# EAGLE schematic MVP (EAGLE 7.5.0)
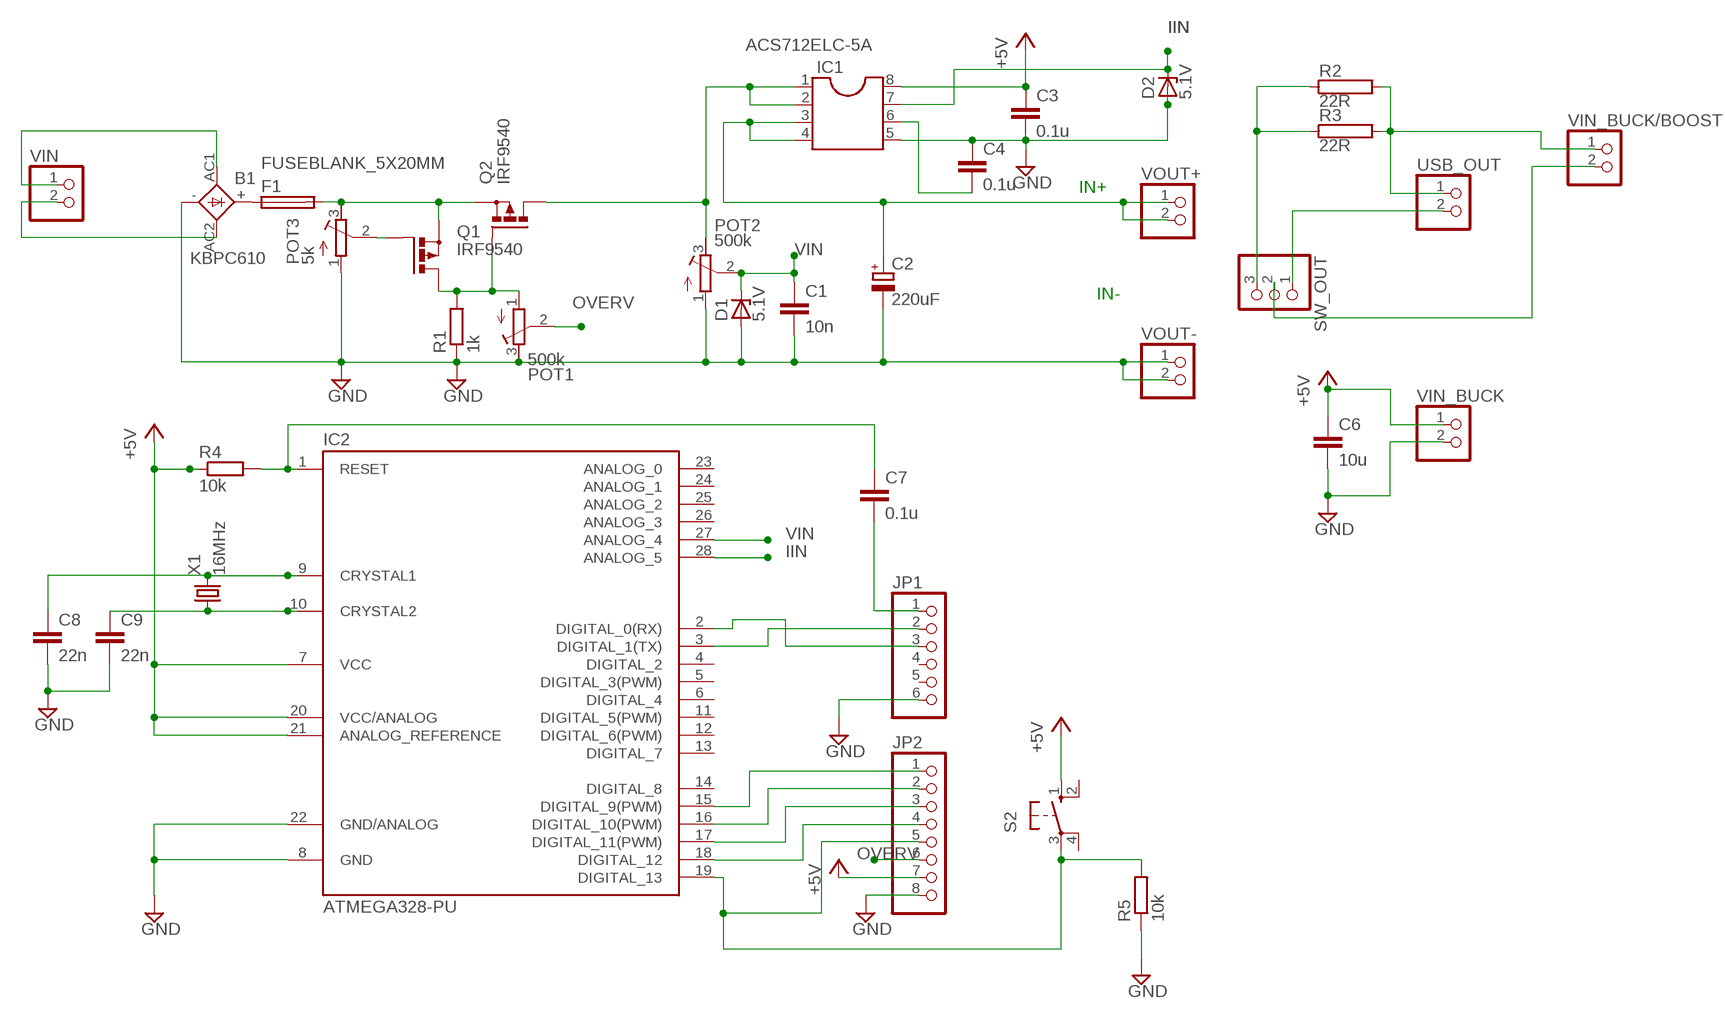
[diagram p0: schematic, sheet 1]

## Parts
B1  KBPC610  GBPC6  [GBPC6]
C1  10n  C-EUC1206K  [C1206K]
C2  220uF  CPOL-EUE3.5-10  [E3,5-10]
C3  0.1u  C-EUC1206K  [C1206K]
C4  0.1u  C-EUC1206K  [C1206K]
C6  10u  C-EUC1206K  [C1206K]
C7  0.1u  C-EUC1206K  [C1206K]
C8  22n  C-EUC0805K  [C0805K]
C9  22n  C-EUC0805K  [C0805K]
D1  5.1V  ZPD  [DO35Z10]
D2  5.1V  ZPD  [DO35Z10]
F1  FUSEBLANK_5X20MM  [FUSE_HOLDER_5X20MM]
IC1  ACS712ELC-5A  SOIC8  [SOIC8]
IC2  ATMEGA328-PU  ATMEGA168-PU  [DIL28-3]
JP1  PINHD-1X6  [1X06]
JP2  PINHD-1X8  [1X08]
POT1  500k  R-TRIMM3296W  [RTRIM3296W]
POT2  500k  R-TRIMM3296W  [RTRIM3296W]
POT3  5k  R-TRIMM3296W  [RTRIM3296W]
Q1  IRF9540  PMOSFET_PTO220BV  [TO220BV]
Q2  IRF9540  PMOSFET_PTO220BV  [TO220BV]
R1  1k  R-EU_VTA52  [VTA52]
R2  22R  RRWM8X45  [RWM8X45]
R3  22R  RRWM8X45  [RWM8X45]
R4  10k  R-EU_R1206  [R1206]
R5  10k  R-EU_R1206  [R1206]
S2  10-XX  [B3F-10XX]
SW_OUT  PINHD-1X3  [1X03]
USB_OUT  PINHD-1X2  [1X02]
VIN  PINHD-1X2  [1X02]
VIN_BUCK  PINHD-1X2  [1X02]
VIN_BUCK/BOOST  PINHD-1X2  [1X02]
VOUT+  PINHD-1X2  [1X02]
VOUT-  PINHD-1X2  [1X02]
X1  16MHz  CRYSTALHC49S  [HC49/S]

## Nets
+5V: C3.1 C6.1 IC1.8 IC2.7(VCC) IC2.20(VCC/ANALOG) IC2.21(ANALOG_REFERENCE) JP2.7 R4.1 S2.1(S) VIN_BUCK.1
GND: B1.- C1.2 C2.- C3.2 C4.1 C6.2 C8.2 C9.2 D1.A D2.A IC1.5 IC2.8(GND) IC2.22(GND/ANALOG) JP1.6 JP2.8 POT1.3(E) POT2.1(A) POT3.1(A) R1.1 R5.1 VIN_BUCK.2 VOUT-.1 VOUT-.2
IIN: D2.C IC1.7 IC2.28(ANALOG_5)
M1S: C2.+ IC1.3 IC1.4 VOUT+.1 VOUT+.2
N$1: B1.+ F1.1
N$2: C4.2 IC1.6
N$3: IC1.1 IC1.2 POT2.3(E) Q2.D
N$4: IC2.3(DIGITAL_1(TX)) JP1.2
N$5: IC2.2(DIGITAL_0(RX)) JP1.3
N$6: IC2.15(DIGITAL_9(PWM)) JP2.1
N$7: POT3.2(S) Q1.G
N$8: IC2.19(DIGITAL_13) JP2.5 R5.2 S2.3(P)
N$9: IC2.16(DIGITAL_10(PWM)) JP2.2
N$10: F1.2 POT3.3(E) Q1.S Q2.S
N$11: IC2.17(DIGITAL_11(PWM)) JP2.3
N$12: IC2.18(DIGITAL_12) JP2.4
N$14: C7.2 JP1.1
N$15: C9.1 IC2.10(CRYSTAL2) X1.1
N$16: C8.1 IC2.9(CRYSTAL1) X1.2
N$17: C7.1 IC2.1(RESET) R4.2
N$19: B1.AC2 VIN.2
N$20: B1.AC1 VIN.1
N$22: SW_OUT.2 VIN_BUCK/BOOST.2
N$23: R2.2 R3.2 USB_OUT.1 VIN_BUCK/BOOST.1
N$24: R2.1 R3.1 SW_OUT.3
N$25: SW_OUT.1 USB_OUT.2
N$35: POT1.1(A) Q1.D Q2.G R1.2
OVERV: JP2.6 POT1.2(S)
VIN: C1.1 D1.C IC2.27(ANALOG_4) POT2.2(S)
Unconnected: IC2.4(DIGITAL_2) IC2.5(DIGITAL_3(PWM)) IC2.6(DIGITAL_4) IC2.11(DIGITAL_5(PWM)) IC2.12(DIGITAL_6(PWM)) IC2.13(DIGITAL_7) IC2.14(DIGITAL_8) IC2.23(ANALOG_0) IC2.24(ANALOG_1) IC2.25(ANALOG_2) IC2.26(ANALOG_3) JP1.4 JP1.5 S2.2(S1) S2.4(P1)

## Notes on the sheet
- IN+
- IN-

## Library data of the parts
B1 = rectifier:GBPC6: GENERAL INSTRUMENT RECTIFIER
C1 C3 C4 C6-C9 = resistor:C-EU: CAPACITOR, European symbol
C2 = resistor:CPOL-EU: POLARIZED CAPACITOR, European symbol
D1 D2 = diode:ZPD: Z DIODE 500 mW
F1 = fuse:FUSE: Fuse; OC_FARNELL: unknown; OC_NEWARK: unknown
IC1 = mylibrary:SOIC8: Dual In Line / Socket
IC2 = Arduino-AVR:ATMEGA168-PU
JP1 = pinhead:PINHD-1X6: PIN HEADER
JP2 = pinhead:PINHD-1X8: PIN HEADER
POT1-POT3 = resistor:R-TRIMM: Trimm resistor
Q1 Q2 = transistor-power:PMOSFET_P: Power MOSFET P-Channel
R1 R4 R5 = resistor:R-EU_: RESISTOR, European symbol
R2 R3 = resistor-power:R: Power Resitor; OC_FARNELL: unknown; OC_NEWARK: unknown
S2 = switch-omron:10-XX: OMRON SWITCH; MPN: B3F-1000; OC_FARNELL: 176432; OC_NEWARK: 36M3542
SW_OUT = pinhead:PINHD-1X3: PIN HEADER
USB_OUT VIN VIN_BUCK VIN_BUCK/BOOST VOUT+ VOUT- = pinhead:PINHD-1X2: PIN HEADER
X1 = crystal:CRYSTAL: CRYSTAL; OC_FARNELL: 1667008; OC_NEWARK: unknown

## Module BB1
Ports: 

### Library data of the parts